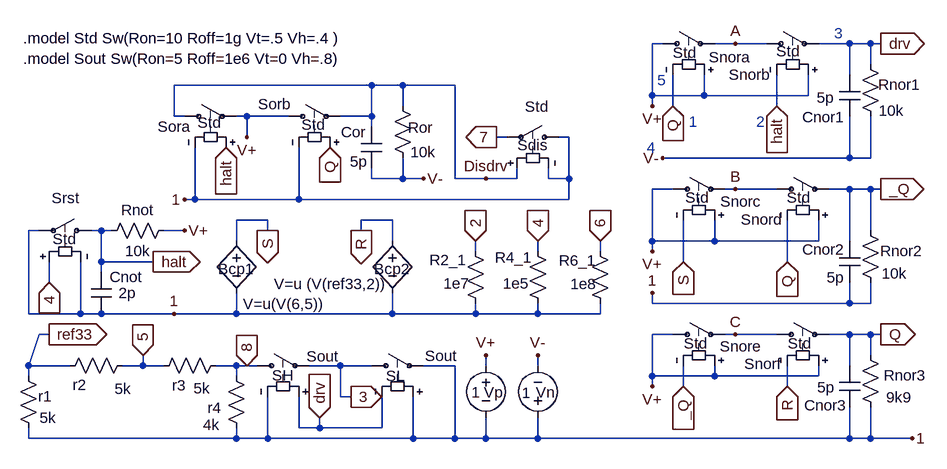
[diagram p0: schematic 555bc.asc]
555bc.asc, the LTspice schematic file:
Version 4
SHEET 1 1424 796
WIRE 384 16 368 16
WIRE 496 16 464 16
WIRE 544 16 496 16
WIRE 672 16 624 16
WIRE 704 16 672 16
WIRE 720 16 704 16
WIRE 704 48 704 16
WIRE 672 64 672 16
WIRE -64 80 -368 80
WIRE -16 80 -64 80
WIRE 64 80 -16 80
WIRE 368 96 368 16
WIRE 448 96 448 64
WIRE 448 96 368 96
WIRE 608 96 608 64
WIRE 608 96 448 96
WIRE -16 112 -16 80
WIRE 368 112 368 96
WIRE 400 112 400 64
WIRE 560 112 560 64
WIRE -368 128 -368 80
WIRE -352 128 -368 128
WIRE -256 128 -272 128
WIRE -192 128 -256 128
WIRE -64 128 -64 80
WIRE -64 128 -112 128
WIRE -64 144 -64 128
WIRE -256 160 -256 128
WIRE 144 160 128 160
WIRE 240 160 224 160
WIRE 672 192 672 128
WIRE 672 192 384 192
WIRE 704 192 704 128
WIRE 704 192 672 192
WIRE -64 224 -64 208
WIRE -16 224 -16 192
WIRE -16 224 -64 224
WIRE 16 224 -16 224
WIRE 64 224 64 80
WIRE 112 224 64 224
WIRE 160 224 160 208
WIRE 160 224 112 224
WIRE 208 224 208 208
WIRE 240 224 240 160
WIRE 240 224 208 224
WIRE 400 240 368 240
WIRE 496 240 480 240
WIRE 560 240 496 240
WIRE 672 240 640 240
WIRE 704 240 672 240
WIRE 720 240 704 240
WIRE -336 256 -336 176
WIRE -336 256 -352 256
WIRE -176 256 -176 176
WIRE -176 256 -336 256
WIRE 240 256 240 224
WIRE 240 256 -176 256
WIRE -224 288 -272 288
WIRE -32 288 -80 288
WIRE -576 304 -592 304
WIRE -480 304 -496 304
WIRE -464 304 -480 304
WIRE -352 304 -384 304
WIRE -224 304 -224 288
WIRE -80 304 -80 288
WIRE 704 304 704 240
WIRE -272 320 -272 288
WIRE -32 320 -32 288
WIRE 368 320 368 240
WIRE 464 320 464 288
WIRE 464 320 368 320
WIRE 624 320 624 288
WIRE 624 320 464 320
WIRE 672 320 672 240
WIRE 96 336 96 320
WIRE 192 336 192 320
WIRE 288 336 288 320
WIRE 368 336 368 320
WIRE -480 352 -480 304
WIRE -400 352 -480 352
WIRE 416 352 416 288
WIRE 576 352 576 288
WIRE -480 368 -480 352
WIRE -560 384 -560 352
WIRE 368 416 368 400
WIRE 672 416 672 384
WIRE 672 416 368 416
WIRE 704 416 704 384
WIRE 704 416 672 416
WIRE -592 432 -592 304
WIRE -512 432 -512 352
WIRE -512 432 -592 432
WIRE -480 432 -512 432
WIRE -368 432 -480 432
WIRE -272 432 -272 400
WIRE -272 432 -368 432
WIRE -32 432 -32 400
WIRE -32 432 -272 432
WIRE 96 432 96 416
WIRE 96 432 -32 432
WIRE 192 432 192 416
WIRE 192 432 96 432
WIRE 288 432 288 416
WIRE 288 432 192 432
WIRE -560 464 -576 464
WIRE 400 464 368 464
WIRE 496 464 480 464
WIRE 560 464 496 464
WIRE 672 464 640 464
WIRE 704 464 672 464
WIRE 720 464 704 464
WIRE 704 496 704 464
WIRE -592 512 -576 464
WIRE -528 512 -592 512
WIRE -416 512 -416 496
WIRE -416 512 -448 512
WIRE -384 512 -416 512
WIRE -272 512 -304 512
WIRE -256 512 -272 512
WIRE -240 512 -256 512
WIRE -112 512 -160 512
WIRE -64 512 -112 512
WIRE 64 512 16 512
WIRE 112 512 112 496
WIRE 192 512 192 496
WIRE 672 512 672 464
WIRE -592 528 -592 512
WIRE -272 528 -272 512
WIRE 368 528 368 464
WIRE 464 528 464 512
WIRE 464 528 368 528
WIRE 624 528 624 512
WIRE 624 528 464 528
WIRE 368 544 368 528
WIRE 416 544 416 512
WIRE 576 544 576 512
WIRE -112 560 -112 512
WIRE -96 560 -112 560
WIRE -176 608 -176 560
WIRE -144 608 -144 592
WIRE -144 608 -176 608
WIRE -48 608 -48 560
WIRE -48 608 -144 608
WIRE -592 624 -592 608
WIRE -272 624 -272 608
WIRE -272 624 -592 624
WIRE -224 624 -224 560
WIRE -224 624 -272 624
WIRE 0 624 0 560
WIRE 0 624 -224 624
WIRE 64 624 64 512
WIRE 64 624 0 624
WIRE 112 624 112 592
WIRE 112 624 64 624
WIRE 192 624 192 592
WIRE 192 624 112 624
WIRE 672 624 672 576
WIRE 672 624 192 624
WIRE 704 624 704 576
WIRE 704 624 672 624
WIRE 768 624 704 624
FLAG -560 464 ref33
IOPIN -560 464 Out
FLAG -416 496 5
IOPIN -416 496 In
FLAG 128 160 7
IOPIN 128 160 Out
FLAG 112 224 Disdrv
FLAG -256 512 8
IOPIN -256 512 In
FLAG -96 560 3
IOPIN -96 560 Out
FLAG -144 592 drv
IOPIN -144 592 In
FLAG 768 624 1
FLAG 192 320 4
IOPIN 192 320 In
FLAG 192 496 V-
FLAG 112 496 V+
FLAG 96 320 2
IOPIN 96 320 In
FLAG -400 352 halt
IOPIN -400 352 Out
FLAG -560 384 4
IOPIN -560 384 In
FLAG -368 432 1
FLAG -352 304 V+
FLAG 720 16 drv
IOPIN 720 16 Out
FLAG 400 112 Q
IOPIN 400 112 In
FLAG 560 112 halt
IOPIN 560 112 In
FLAG 384 192 V-
FLAG 368 112 V+
FLAG 720 240 _Q
IOPIN 720 240 Out
FLAG 416 352 S
IOPIN 416 352 In
FLAG 576 352 Q
IOPIN 576 352 In
FLAG 368 400 1
FLAG 368 336 V+
FLAG 720 464 Q
IOPIN 720 464 Out
FLAG 416 544 _Q
IOPIN 416 544 In
FLAG 576 544 R
IOPIN 576 544 In
FLAG 368 544 V+
FLAG -288 176 halt
IOPIN -288 176 In
FLAG -128 176 Q
IOPIN -128 176 In
FLAG 16 224 V-
FLAG -256 160 V+
FLAG 496 16 A
FLAG 496 240 B
FLAG 496 464 C
FLAG 288 320 6
IOPIN 288 320 In
FLAG -224 304 S
IOPIN -224 304 Out
FLAG -80 304 R
IOPIN -80 304 Out
FLAG -352 256 1
SYMBOL res -608 512 R0
WINDOW 0 31 47 Left 2
WINDOW 3 33 80 Left 2
SYMATTR InstName r1
SYMATTR Value 5k
SYMBOL res -432 496 R90
WINDOW 0 61 81 VBottom 2
WINDOW 3 36 15 VTop 2
SYMATTR InstName r2
SYMATTR Value 5k
SYMBOL res -288 496 R90
WINDOW 0 62 72 VBottom 2
WINDOW 3 35 37 VTop 2
SYMATTR InstName r3
SYMATTR Value 5k
SYMBOL sw 240 160 M270
WINDOW 0 -12 33 VRight 2
WINDOW 3 47 32 VRight 2
SYMATTR InstName Sdis
SYMATTR Value Std
SYMBOL sw -256 512 R270
WINDOW 0 -15 39 VRight 2
WINDOW 3 14 92 VRight 2
SYMATTR InstName SH
SYMATTR Value Sout
SYMBOL sw -80 512 R270
WINDOW 0 -16 38 VRight 2
WINDOW 3 15 98 VRight 2
SYMATTR InstName SL
SYMATTR Value Sout
SYMBOL res -256 624 R180
WINDOW 0 39 47 Left 2
WINDOW 3 42 21 Left 2
SYMATTR InstName r4
SYMATTR Value 4k
SYMBOL voltage 112 496 R0
WINDOW 0 -3 57 Left 2
WINDOW 3 -22 57 Left 2
SYMATTR InstName Vp
SYMATTR Value 1
SYMBOL voltage 192 608 R180
WINDOW 0 -26 55 Left 2
WINDOW 3 11 54 Left 2
SYMATTR InstName Vn
SYMATTR Value 1
SYMBOL res 80 320 R0
WINDOW 0 -55 29 Left 2
WINDOW 3 -33 65 Left 2
SYMATTR InstName R2_1
SYMATTR Value 1e7
SYMBOL sw -480 304 M270
WINDOW 0 50 34 VRight 2
WINDOW 3 -13 75 VLeft 2
SYMATTR InstName Srst
SYMATTR Value Std
SYMBOL res -480 320 R270
WINDOW 0 32 56 VTop 2
WINDOW 3 0 56 VBottom 2
SYMATTR InstName Rnot
SYMATTR Value 10k
SYMBOL sw 368 16 R270
WINDOW 0 -21 87 VRight 2
WINDOW 3 -14 32 VRight 2
SYMATTR InstName Snora
SYMATTR Value Std
SYMBOL sw 528 16 R270
WINDOW 0 -48 -42 VRight 2
WINDOW 3 -12 31 VRight 2
SYMATTR InstName Snorb
SYMATTR Value Std
SYMBOL sw 384 240 R270
WINDOW 0 -19 89 VRight 2
WINDOW 3 -13 35 VRight 2
SYMATTR InstName Snorc
SYMATTR Value Std
SYMBOL sw 544 240 R270
WINDOW 0 -47 -40 VRight 2
WINDOW 3 -13 31 VRight 2
SYMATTR InstName Snord
SYMATTR Value Std
SYMBOL sw 384 464 R270
WINDOW 0 -18 88 VRight 2
WINDOW 3 -14 33 VRight 2
SYMATTR InstName Snore
SYMATTR Value Std
SYMBOL sw 544 464 R270
WINDOW 0 -45 -34 VRight 2
WINDOW 3 -14 33 VRight 2
SYMATTR InstName Snorf
SYMATTR Value Std
SYMBOL sw -368 128 R270
WINDOW 0 -16 -25 VRight 2
WINDOW 3 -10 36 VRight 2
SYMATTR InstName Sora
SYMATTR Value Std
SYMBOL sw -208 128 R270
WINDOW 0 19 -31 VRight 2
WINDOW 3 -13 36 VRight 2
SYMATTR InstName Sorb
SYMATTR Value Std
SYMBOL res -32 96 R0
WINDOW 0 24 49 Left 2
WINDOW 3 28 87 Left 2
SYMATTR InstName Ror
SYMATTR Value 10k
SYMBOL res 688 32 R0
WINDOW 0 28 47 Left 2
WINDOW 3 29 87 Left 2
SYMATTR InstName Rnor1
SYMATTR Value 10k
SYMBOL res 688 288 R0
WINDOW 0 31 47 Left 2
WINDOW 3 33 82 Left 2
SYMATTR InstName Rnor2
SYMATTR Value 10k
SYMBOL res 688 480 R0
WINDOW 0 36 47 Left 2
WINDOW 3 40 81 Left 2
SYMATTR InstName Rnor3
SYMATTR Value 9k9
SYMBOL cap -48 144 M0
WINDOW 3 22 54 Left 2
SYMATTR Value 5p
SYMATTR InstName Cor
SYMBOL cap -496 368 R0
WINDOW 0 29 7 Left 2
WINDOW 3 43 32 Left 2
SYMATTR InstName Cnot
SYMATTR Value 2p
SYMBOL cap 688 64 M0
WINDOW 0 23 65 Left 2
WINDOW 3 40 35 Left 2
SYMATTR InstName Cnor1
SYMATTR Value 5p
SYMBOL cap 688 320 M0
WINDOW 0 23 13 Left 2
SYMATTR InstName Cnor2
SYMATTR Value 5p
SYMBOL cap 688 512 M0
WINDOW 0 20 61 Left 2
WINDOW 3 39 33 Left 2
SYMATTR InstName Cnor3
SYMATTR Value 5p
SYMBOL res 176 320 R0
WINDOW 0 -50 25 Left 2
WINDOW 3 -38 65 Left 2
SYMATTR InstName R4_1
SYMATTR Value 1e5
SYMBOL res 272 320 R0
WINDOW 0 -48 30 Left 2
WINDOW 3 -30 66 Left 2
SYMATTR InstName R6_1
SYMATTR Value 1e8
SYMBOL bv -272 304 R0
WINDOW 0 -28 59 Left 2
WINDOW 3 10 113 Left 2
SYMATTR InstName Bcp1
SYMATTR Value V=u(V(6,5))
SYMBOL bv -32 304 R0
WINDOW 0 -28 59 Left 2
WINDOW 3 -182 82 Left 2
SYMATTR InstName Bcp2
SYMATTR Value V=u (V(ref33,2))
TEXT 424 136 Left 2 ;1
TEXT 528 136 Left 2 ;2
TEXT 376 72 Left 2 ;5
TEXT 648 0 Left 2 ;3
TEXT 360 176 Left 2 ;4
TEXT -600 8 Left 2 !.model Std Sw(Ron=10 Roff=1g Vt=.5 Vh=.4 )\n.model Sout Sw(Ron=5 Roff=1e6 Vt=0 Vh=.8)

The netlist it stands for:
* 555bc.asc
r1 ref33 1 5k
r2 5 ref33 5k
r3 8 5 5k
Sdis 1 7 Disdrv 1 Std
SH 8 3 drv 1 Sout
SL 3 1 1 drv Sout
r4 1 8 4k
Vp V+ 1 1
Vn 1 V- 1
R2_1 2 1 1e7
Srst halt 1 4 1 Std
Rnot halt V+ 10k
Snora V+ A V+ Q Std
Snorb A drv V+ halt Std
Snorc V+ B V+ S Std
Snord B _Q V+ Q Std
Snore V+ C V+ _Q Std
Snorf C Q V+ R Std
Sora Disdrv V+ halt 1 Std
Sorb V+ Disdrv Q 1 Std
Ror Disdrv V- 10k
Rnor1 drv V- 10k
Rnor2 _Q 1 10k
Rnor3 Q 1 9k9
Cor Disdrv V- 5p
Cnot halt 1 2p
Cnor1 drv V- 5p
Cnor2 _Q 1 5p
Cnor3 Q 1 5p
R4_1 4 1 1e5
R6_1 6 1 1e8
Bcp1 S 1 V=u(V(6,5))
Bcp2 R 1 V=u (V(ref33,2))
* 1
* 2
* 5
* 3
* 4
.model Std Sw(Ron=10 Roff=1g Vt=.5 Vh=.4 )
.model Sout Sw(Ron=5 Roff=1e6 Vt=0 Vh=.8)
.backanno
.end